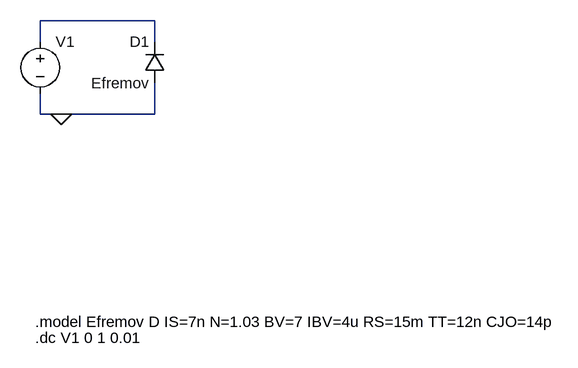
[diagram p0: schematic task_2.asc]
task_2.asc, the LTspice schematic file:
Version 4
SHEET 1 1044 680
WIRE 272 -160 96 -160
WIRE 96 -128 96 -160
WIRE 272 -128 272 -160
WIRE 96 -16 96 -48
WIRE 128 -16 96 -16
WIRE 272 -16 272 -64
WIRE 272 -16 128 -16
FLAG 128 -16 0
SYMBOL voltage 96 -144 R0
WINDOW 123 0 0 Left 2
WINDOW 39 0 0 Left 2
SYMATTR InstName V1
SYMATTR Value ""
SYMBOL diode 288 -64 R180
WINDOW 0 24 64 Left 2
WINDOW 3 24 0 Left 2
SYMATTR InstName D1
SYMATTR Value Efremov
TEXT 88 304 Left 2 !.model Efremov D IS=7n N=1.03 BV=7 IBV=4u RS=15m TT=12n CJO=14p
TEXT 88 328 Left 2 !.dc V1 0 1 0.01

The netlist it stands for:
* task_2.asc
V1 N001 0
D1 0 N001 Efremov
.model D D
.lib standard.dio
.model Efremov D IS=7n N=1.03 BV=7 IBV=4u RS=15m TT=12n CJO=14p
.dc V1 0 1 0.01
.backanno
.end